# Altium schematic sheet SCH-2-Main Controls.SchDoc
size Letter
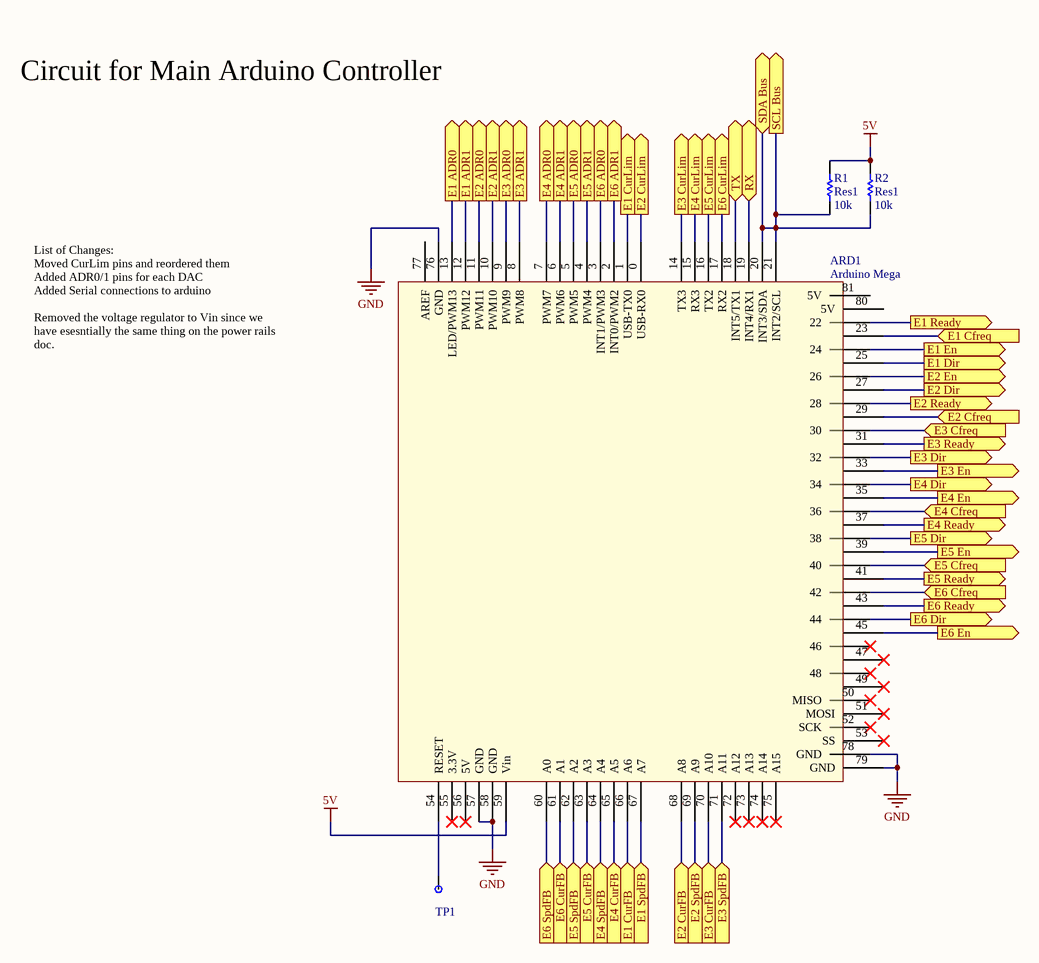
[diagram p0: SCH-2-Main Controls.SchDoc]

## Parts
ARD1  Arduino Mega  [Arduino Mega]
R1  Res1  value 10k  [RESC1608X06N_0603]
R2  Res1  value 10k  [RESC1608X06N_0603]
TP1  TestPt  [50_MIL_PAD]  (value not drawn)

## Ports
E1 ADR0 (out), E1 ADR1 (out), E1 Cfreq (in), E1 CurFB (in), E1 CurLim (out), E1 Dir (out), E1 En (out), E1 Ready (out), E1 SpdFB (in), E2 ADR0 (out), E2 ADR1 (out), E2 Cfreq (in), E2 CurFB (in), E2 CurLim (out), E2 Dir (out), E2 En (out), E2 Ready (out), E2 SpdFB (in), E3 ADR0 (out), E3 ADR1 (out), E3 Cfreq (in), E3 CurFB (in), E3 CurLim (out), E3 Dir (out), E3 En (out), E3 Ready (out), E3 SpdFB (in), E4 ADR0 (out), E4 ADR1 (out), E4 Cfreq (in), E4 CurFB (in), E4 CurLim (out), E4 Dir (out), E4 En (out), E4 Ready (out), E4 SpdFB (in), E5 ADR0 (out), E5 ADR1 (out), E5 Cfreq (in), E5 CurFB (in), E5 CurLim (out), E5 Dir (out), E5 En (out), E5 Ready (out), E5 SpdFB (in), E6 ADR0 (out), E6 ADR1 (out), E6 Cfreq (in), E6 CurFB (in), E6 CurLim (out), E6 Dir (out), E6 En (out), E6 Ready (out), E6 SpdFB (in), RX (bidir), SCL Bus (out), SDA Bus (bidir), TX (bidir)

## Nets
5V: ARD1.59(Vin) R1.2 R2.2
GND: ARD1.57(GND) ARD1.58(GND) ARD1.76(GND) ARD1.78(GND) ARD1.79(GND)
E1 ADR0: ARD1.13(LED/PWM13) ; port E1 ADR0
E1 ADR1: ARD1.12(PWM12) ; port E1 ADR1
E1 Cfreq: ARD1.23 ; port E1 Cfreq
E1 CurFB: ARD1.66(A6) ; port E1 CurFB
E1 CurLim: ARD1.1(USB-TX0) ; port E1 CurLim
E1 Dir: ARD1.25 ; port E1 Dir
E1 En: ARD1.24 ; port E1 En
E1 Ready: ARD1.22 ; port E1 Ready
E1 SpdFB: ARD1.67(A7) ; port E1 SpdFB
E2 ADR0: ARD1.11(PWM11) ; port E2 ADR0
E2 ADR1: ARD1.10(PWM10) ; port E2 ADR1
E2 Cfreq: ARD1.29 ; port E2 Cfreq
E2 CurFB: ARD1.68(A8) ; port E2 CurFB
E2 CurLim: ARD1.0(USB-RX0) ; port E2 CurLim
E2 Dir: ARD1.27 ; port E2 Dir
E2 En: ARD1.26 ; port E2 En
E2 Ready: ARD1.28 ; port E2 Ready
E2 SpdFB: ARD1.69(A9) ; port E2 SpdFB
E3 ADR0: ARD1.9(PWM9) ; port E3 ADR0
E3 ADR1: ARD1.8(PWM8) ; port E3 ADR1
E3 Cfreq: ARD1.30 ; port E3 Cfreq
E3 CurFB: ARD1.70(A10) ; port E3 CurFB
E3 CurLim: ARD1.14(TX3) ; port E3 CurLim
E3 Dir: ARD1.32 ; port E3 Dir
E3 En: ARD1.33 ; port E3 En
E3 Ready: ARD1.31 ; port E3 Ready
E3 SpdFB: ARD1.71(A11) ; port E3 SpdFB
E4 ADR0: ARD1.7(PWM7) ; port E4 ADR0
E4 ADR1: ARD1.6(PWM6) ; port E4 ADR1
E4 Cfreq: ARD1.36 ; port E4 Cfreq
E4 CurFB: ARD1.65(A5) ; port E4 CurFB
E4 CurLim: ARD1.15(RX3) ; port E4 CurLim
E4 Dir: ARD1.34 ; port E4 Dir
E4 En: ARD1.35 ; port E4 En
E4 Ready: ARD1.37 ; port E4 Ready
E4 SpdFB: ARD1.64(A4) ; port E4 SpdFB
E5 ADR0: ARD1.5(PWM5) ; port E5 ADR0
E5 ADR1: ARD1.4(PWM4) ; port E5 ADR1
E5 Cfreq: ARD1.40 ; port E5 Cfreq
E5 CurFB: ARD1.63(A3) ; port E5 CurFB
E5 CurLim: ARD1.16(TX2) ; port E5 CurLim
E5 Dir: ARD1.38 ; port E5 Dir
E5 En: ARD1.39 ; port E5 En
E5 Ready: ARD1.41 ; port E5 Ready
E5 SpdFB: ARD1.62(A2) ; port E5 SpdFB
E6 ADR0: ARD1.3(INT1/PWM3) ; port E6 ADR0
E6 ADR1: ARD1.2(INT0/PWM2) ; port E6 ADR1
E6 Cfreq: ARD1.42 ; port E6 Cfreq
E6 CurFB: ARD1.61(A1) ; port E6 CurFB
E6 CurLim: ARD1.17(RX2) ; port E6 CurLim
E6 Dir: ARD1.44 ; port E6 Dir
E6 En: ARD1.45 ; port E6 En
E6 Ready: ARD1.43 ; port E6 Ready
E6 SpdFB: ARD1.60(A0) ; port E6 SpdFB
RX: ARD1.19(INT4/RX1) ; port RX
SCL Bus: ARD1.20(INT3/SDA) ARD1.21(INT2/SCL) R1.1 R2.1 ; port SCL Bus, port SDA Bus
TX: ARD1.18(INT5/TX1) ; port TX
NetARD1_54: ARD1.54(RESET) TP1.1

Not connected (* = marked no-connect by the designer): ARD1 46* 47* 48* 49* 50(MISO)* 51(MOSI)* 52(SCK)* 53(SS)* 55(3.3V)* 56(5V)* 72(A12)* 73(A13)* 74(A14)* 75(A15)* 77(AREF) 80(5V) 81(5V)

## Notes on the sheet
- Circuit for Main Arduino Controller
- List of Changes:
  Moved CurLim pins and reordered them
  Added ADR0/1 pins for each DAC
  Added Serial connections to arduino
  Removed the voltage regulator to Vin since we have esesntially the same thing on the power rails doc.

## Library data of the parts
R1 R2 = Res1: Resistor; Published: 8-Jun-2000; LatestRevisionDate: 17-Jul-2002; LatestRevisionNote: Re-released for DXP Platform.; PackageReference: AXIAL-0.3; Publisher: Altium Limited; PackageDescription: Axial Device, Thru-Hole; 2 Leads; 0.3 in Pin Spacing